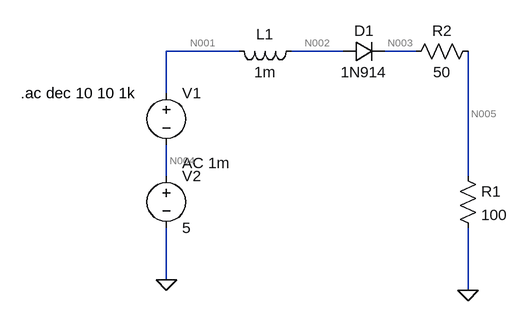
[diagram p0: schematic diode test.asc]
diode test.asc, the LTspice schematic file:
Version 4
SHEET 1 880 680
WIRE 176 -96 64 -96
WIRE 336 -96 256 -96
WIRE 448 -96 400 -96
WIRE 64 -32 64 -96
WIRE 64 96 64 48
WIRE 528 96 528 -96
WIRE 64 256 64 176
WIRE 528 272 528 176
FLAG 528 272 0
FLAG 64 256 0
SYMBOL ind 272 -112 R90
WINDOW 0 5 56 VBottom 2
WINDOW 3 32 56 VTop 2
SYMATTR InstName L1
SYMATTR Value 1m
SYMBOL res 512 80 R0
SYMATTR InstName R1
SYMATTR Value 100
SYMBOL diode 336 -80 R270
WINDOW 0 32 32 VTop 2
WINDOW 3 0 32 VBottom 2
SYMATTR InstName D1
SYMATTR Value 1N914
SYMBOL voltage 64 -48 R0
WINDOW 123 24 124 Left 2
WINDOW 39 0 0 Left 0
SYMATTR InstName V1
SYMATTR Value ""
SYMATTR Value2 AC 1m
SYMBOL voltage 64 80 R0
WINDOW 123 0 0 Left 0
WINDOW 39 0 0 Left 0
SYMATTR InstName V2
SYMATTR Value 5
SYMBOL res 544 -112 R90
WINDOW 0 0 56 VBottom 2
WINDOW 3 32 56 VTop 2
SYMATTR InstName R2
SYMATTR Value 50
TEXT -160 -32 Left 2 !.ac dec 10 10 1k

The netlist it stands for:
* diode test.asc
L1 N002 N001 1m
R1 N005 0 100
D1 N002 N003 1N914
V1 N001 N004 AC 1m
V2 N004 0 5
R2 N005 N003 50
.model D D
.lib standard.dio
.ac dec 10 10 1k
.backanno
.end

* Results of the author's LTspice run, read from the files saved beside the schematic
* Operating Point, zero values left out:
*   V(n002) = 5 V
*   V(n001) = 5 V
*   V(n005) = 2.832 V
*   V(n003) = 4.248 V
*   V(n004) = 5 V
*   I(D1) = 28.32 mA
*   I(L1) = -28.32 mA
*   I(R2) = -28.32 mA
*   I(R1) = 28.32 mA
*   I(V2) = -28.32 mA
*   I(V1) = -28.32 mA